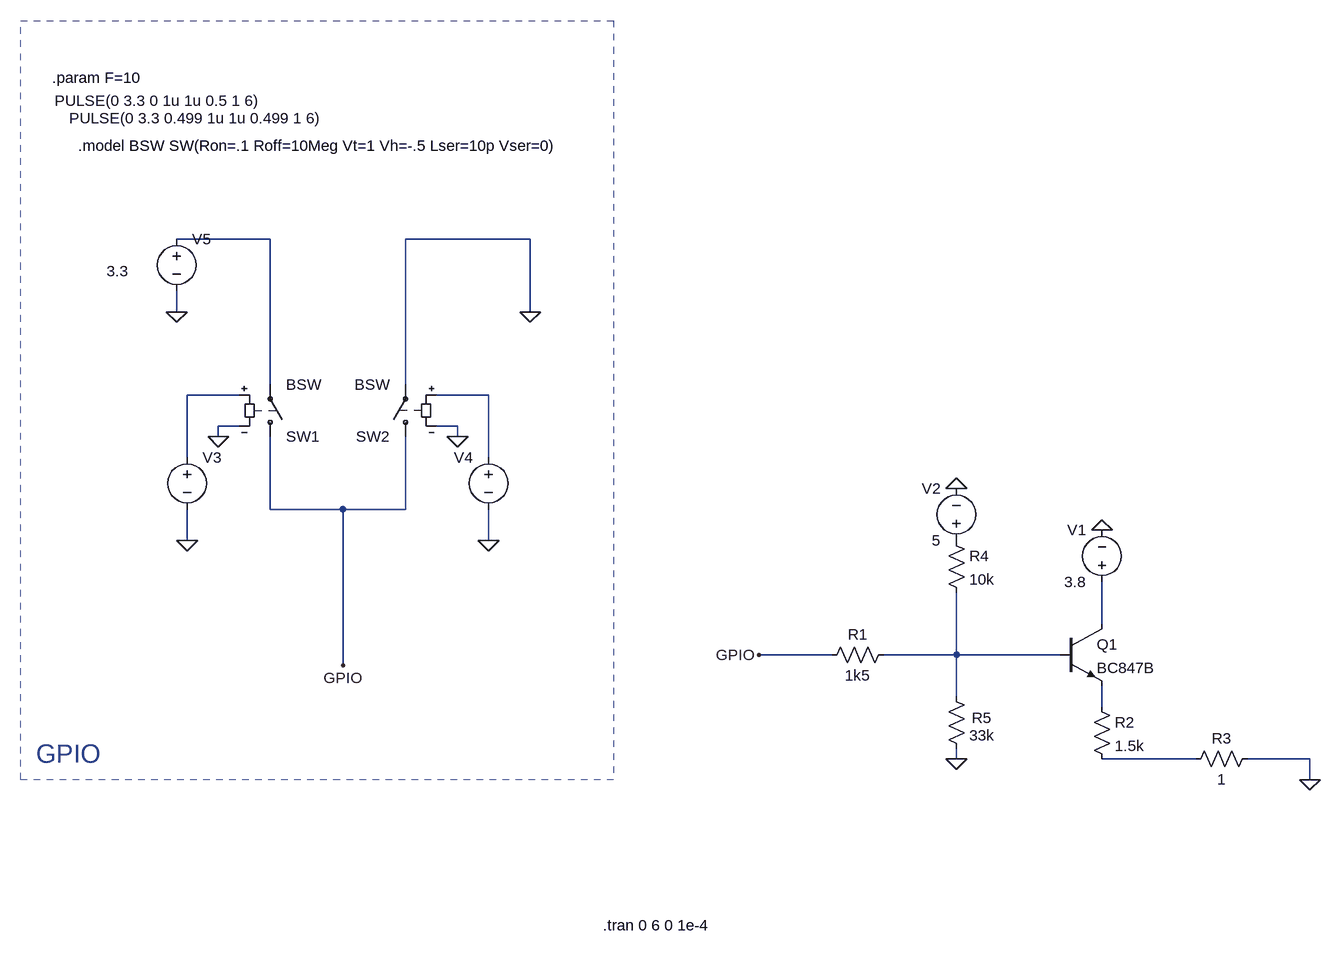
[diagram p0: schematic transistor_pullup_switch.asc]
transistor_pullup_switch.asc, the LTspice schematic file:
Version 4
SHEET 1 880 680
WIRE -1088 -512 -1232 -512
WIRE -688 -512 -880 -512
WIRE -1232 -400 -1232 -432
WIRE -688 -400 -688 -512
WIRE -1088 -288 -1088 -512
WIRE -880 -288 -880 -512
WIRE -1136 -272 -1216 -272
WIRE -752 -272 -832 -272
WIRE -1136 -224 -1168 -224
WIRE -800 -224 -832 -224
WIRE -1168 -208 -1168 -224
WIRE -800 -208 -800 -224
WIRE -1216 -176 -1216 -272
WIRE -752 -176 -752 -272
WIRE -1088 -96 -1088 -208
WIRE -976 -96 -1088 -96
WIRE -880 -96 -880 -208
WIRE -880 -96 -976 -96
WIRE -1216 -48 -1216 -96
WIRE -752 -48 -752 -96
WIRE 192 80 192 16
WIRE -224 128 -336 128
WIRE -32 128 -32 32
WIRE -32 128 -144 128
WIRE 128 128 -32 128
WIRE -976 144 -976 -96
WIRE -32 192 -32 128
WIRE 192 208 192 176
WIRE -32 288 -32 272
WIRE 336 288 192 288
WIRE 512 288 416 288
WIRE 512 320 512 288
FLAG 192 -64 0
FLAG 512 320 0
FLAG -32 288 0
FLAG -32 -128 0
FLAG -1216 -48 0
FLAG -1168 -208 0
FLAG -800 -208 0
FLAG -1232 -400 0
FLAG -752 -48 0
FLAG -976 144 GPIO
FLAG -688 -400 0
FLAG -336 128 GPIO
SYMBOL npn 128 80 R0
SYMATTR InstName Q1
SYMATTR Value BC847B
SYMBOL res -128 112 R90
WINDOW 0 0 56 VBottom 2
WINDOW 3 32 56 VTop 2
SYMATTR InstName R1
SYMATTR Value 1k5
SYMBOL voltage 192 32 R180
WINDOW 0 24 96 Left 2
WINDOW 3 24 16 Left 2
WINDOW 123 0 0 Left 0
WINDOW 39 0 0 Left 0
SYMATTR InstName V1
SYMATTR Value 3.8
SYMBOL res 176 192 R0
SYMATTR InstName R2
SYMATTR Value 1.5k
SYMBOL res 432 272 R90
WINDOW 0 0 56 VBottom 2
WINDOW 3 32 56 VTop 2
SYMATTR InstName R3
SYMATTR Value 1
SYMBOL res -48 -64 R0
SYMATTR InstName R4
SYMATTR Value 10k
SYMBOL res -48 176 R0
WINDOW 0 40 49 Left 2
SYMATTR InstName R5
SYMATTR Value 33k
SYMBOL voltage -32 -32 R180
WINDOW 0 24 96 Left 2
WINDOW 3 24 16 Left 2
WINDOW 123 0 0 Left 0
WINDOW 39 0 0 Left 0
SYMATTR InstName V2
SYMATTR Value 5
SYMBOL voltage -1216 -192 R0
WINDOW 3 -204 -533 Left 2
WINDOW 123 0 0 Left 0
WINDOW 39 0 0 Left 0
SYMATTR Value PULSE(0 3.3 0 1u 1u 0.5 1 6)
SYMATTR InstName V3
SYMBOL sw -1088 -192 M180
SYMATTR InstName SW1
SYMATTR Value BSW
SYMBOL voltage -752 -192 M0
WINDOW 3 254 -506 Left 2
WINDOW 123 0 0 Left 0
WINDOW 39 0 0 Left 0
SYMATTR Value PULSE(0 3.3 0.499 1u 1u 0.499 1 6)
SYMATTR InstName V4
SYMBOL sw -880 -192 R180
SYMATTR InstName SW2
SYMATTR Value BSW
SYMBOL voltage -1232 -528 R0
WINDOW 3 -108 65 Left 2
WINDOW 123 0 0 Left 0
WINDOW 39 0 0 Left 0
SYMATTR Value 3.3
SYMATTR InstName V5
TEXT -576 544 Left 2 !.tran 0 6 0 1e-4
TEXT -1424 -760 Left 2 !.param F=10
TEXT -1384 -656 Left 2 !.model BSW SW(Ron=.1 Roff=10Meg Vt=1 Vh=-.5 Lser=10p Vser=0)
TEXT -1448 280 Left 4 ;GPIO
RECTANGLE Normal -560 320 -1472 -848 2

The netlist it stands for:
* transistor_pullup_switch.asc
Q1 N004 N005 N006 0 BC847B
R1 N005 GPIO 1k5
V1 N004 0 3.8
R2 N006 N007 1.5k
R3 0 N007 1
R4 P001 N005 10k
R5 N005 0 33k
V2 P001 0 5
V3 N002 0 PULSE(0 3.3 0 1u 1u 0.5 1 6)
SW1 GPIO N001 N002 0 BSW
V4 N003 0 PULSE(0 3.3 0.499 1u 1u 0.499 1 6)
SW2 GPIO 0 N003 0 BSW
V5 N001 0 3.3
.model NPN NPN
.model PNP PNP
.lib standard.bjt
.tran 0 6 0 1e-4
.param F=10
.model BSW SW(Ron=.1 Roff=10Meg Vt=1 Vh=-.5 Lser=10p Vser=0)
* GPIO
.backanno
.end